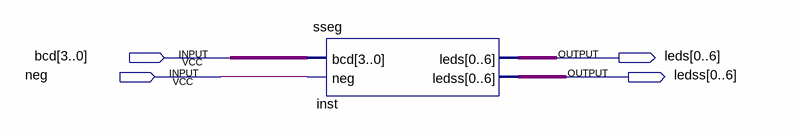
[diagram p0: schematic sheet]
// Quartus schematic ssegblock.bdf as structural Verilog: 1 symbols, 4 pins
module ssegblock (
  input  [3:0] bcd,
  input  neg,
  output [0:6] leds,
  output [0:6] ledss
);

  sseg inst (.bcd(bcd), .neg(neg), .leds(leds), .ledss(ledss));
endmodule
